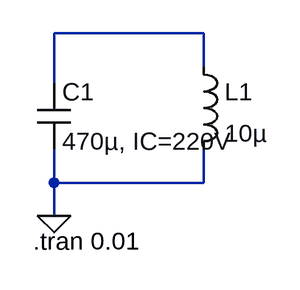
[diagram p0: schematic Draft2.asc]
Draft2.asc, the LTspice schematic file:
Version 4
SHEET 1 880 680
WIRE 192 48 48 48
WIRE 192 80 192 48
WIRE 48 96 48 48
WIRE 48 192 48 160
WIRE 192 192 192 160
WIRE 192 192 48 192
WIRE 48 224 48 192
FLAG 48 224 0
SYMBOL ind 176 64 R0
SYMATTR InstName L1
SYMATTR Value 10µ
SYMBOL cap 32 96 R0
SYMATTR InstName C1
SYMATTR Value 470µ, IC=220V
SYMATTR SpiceLine V=220
TEXT 28 248 Left 2 !.tran 0.01

The netlist it stands for:
* Draft2.asc
L1 N001 0 10µ
C1 N001 0 470µ, IC=220V V=220
.tran 0.01
.backanno
.end